# Altium schematic sheet Regulator.SchDoc: Regulator
size A4; DocumentNumber: 3; SheetNumber: 3; SheetTotal: 5
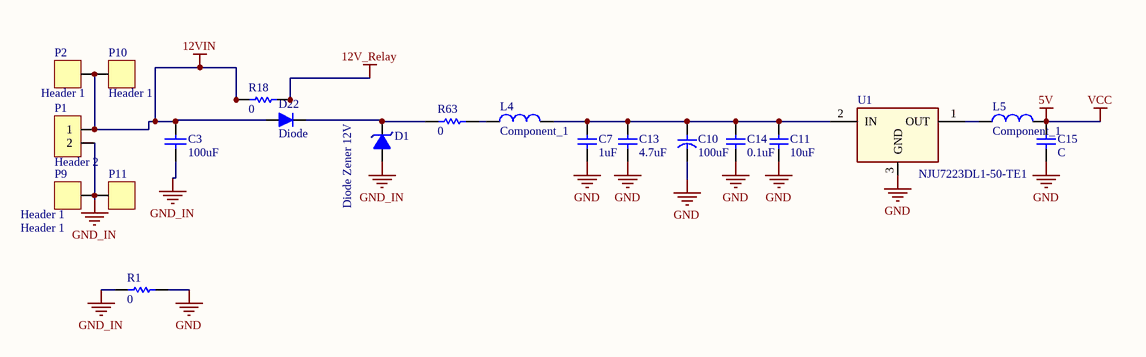
[diagram p0: Regulator.SchDoc]

## Parts
C3  value 100uF  [Cap Non-Pol 5mm]  (hidden comment: Cap Non-pol)
C7  1uF  [C 0805 (2012)]
C10  100uF  [C SMD ALU (B)]
C11  10uF  [C 0805]
C13  4.7uF  [C 0805 (2012)]
C14  0.1uF  [C 0805]
C15  C  [C 0805]
D1  Diode Zener 12V  [DO-214AC (SMA)]
D22  Diode  [DO-214AC (SMA)]
L4  Component_1  [C 1210]
L5  Component_1  [C 1210]
P1  Header 2  [HDR Domino 2]
P2  Header 1  [HDR/Terminal/1/screw]
P9  Header 1  [HDR/Terminal/1/screw]
P10  Header 1  [HDR/Terminal/1/copper/6.0]
P11  Header 1  [HDR/Terminal/1/copper/6.0]
R1  0  [R 0805]
R18  0  [R 0805 (2012)]
R63  0  [R 0805]
U1  NJU7223DL1-50-TE1  [TO-252 (DPAK)]

## Nets
5V: C15.1 L5.2  [also labelled VCC]
12V_Relay: R18.2
12VIN: C3.2 D22.1(A) P1.1 P2.1 P10.1 R18.1
GND: C7.2 C10.2 C11.2 C13.2 C14.2 C15.2 R1.1 U1.3(GND)
GND_IN: C3.1 D1.1(A) P1.2 P9.1 P11.1 R1.2
NetC7_1: C7.1 C10.1 C11.1 C13.1 C14.1 L4.2 U1.2(IN)
NetD1_2: D1.2(K) D22.2(K) R63.2
NetL4_1: L4.1 R63.1
NetL5_1: L5.1 U1.1(OUT)

## Notes on the sheet
- Title
- Size:
- Date:
- A4
- Number:
- Time:
- Revision:
- Sheet
- of
- NPN
- Lab
- File:

## Library data of the parts
C3 = Cap Non-pol: Non-polarized Capacitor; Published: 8-Jun-2000; LatestRevisionDate: 17-Jul-2002; LatestRevisionNote: Re-released for DXP Platform.; PackageReference: RAD-0.3; Publisher: Altium Limited
C7 C11 C13-C15 = Capacitor NP: Capacitor non-pol
C10 = Capacitor: Capacitor pol
D1 = Zener
D22 = Diode: Default Diode
P1 = Header 2: Header, 2-Pin; LatestRevisionDate: 17-Jul-2002; LatestRevisionNote: Re-released for DXP Platform.; Publisher: Altium Limited
P2 P9-P11 = Header 1: Header, 1-Pin
R1 R18 R63 = Resistor: Published: 8-Jun-2000; LatestRevisionDate: 17-Jul-2002; LatestRevisionNote: Re-released for DXP Platform.; PackageReference: AXIAL-0.3; Publisher: Altium Limited
U1 = 78xx: LDO Fixed Voltage regulator